# Altium schematic sheet Accessory.SchDoc
size Letter; SheetNumber: 2; SheetTotal: 4
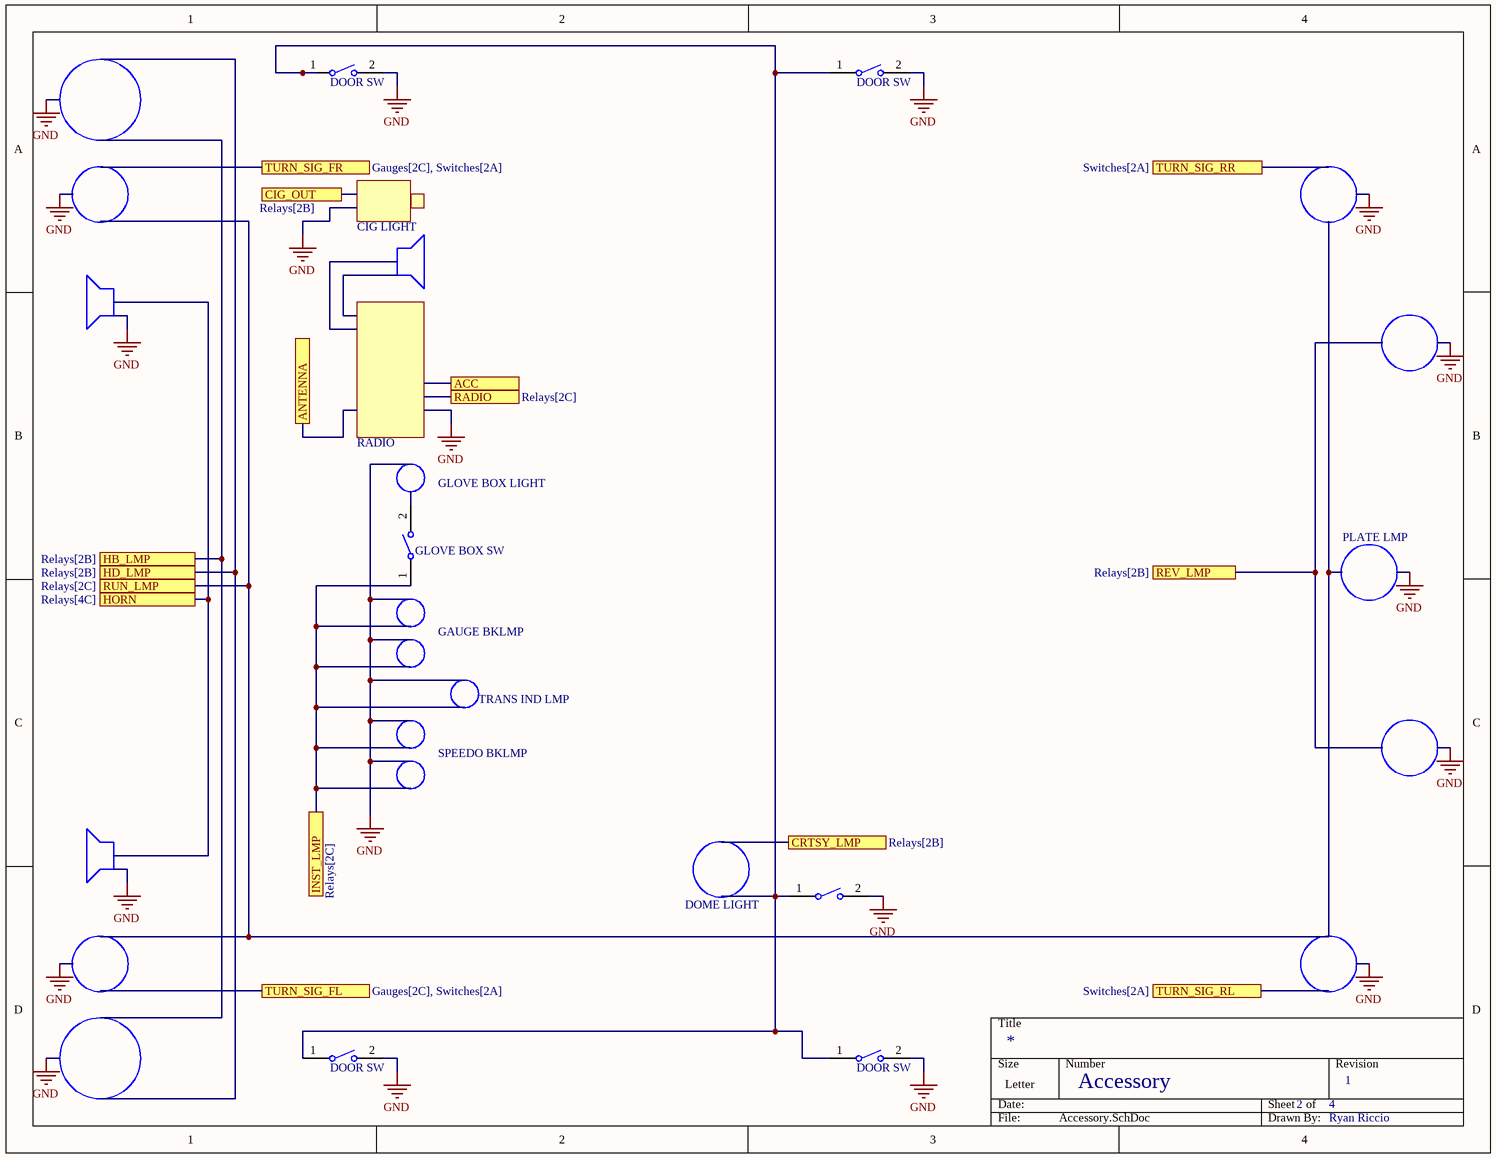
[diagram p0: Accessory.SchDoc]

## Parts
(Parts that share a designator on the sheet are numbered #1, #2 ... from top to bottom, then left to right.)
?#1  DOOR SW  [OMRON-B3U-3000P_V]
?#2  DOOR SW  [OMRON-B3U-3000P_V]
?#3  GLOVE BOX SW  [OMRON-B3U-3000P_V]
?#4  (no value)  [OMRON-B3U-3000P_V]
?#5  DOOR SW  [OMRON-B3U-3000P_V]
?#6  DOOR SW  [OMRON-B3U-3000P_V]

## Ports
ACC (see Relays[1A], Switches[1D]), ANTENNA, CIG_OUT (see Relays[2B]), CRTSY_LMP (see Relays[2B]), HB_LMP (see Relays[2B]), HD_LMP (see Relays[2B]), HORN (see Relays[4C]), INST_LMP (see Relays[2C]), RADIO (see Relays[2C]), REV_LMP (see Relays[2B]), RUN_LMP (see Relays[2C]), TURN_SIG_FL (see Gauges[2C], Switches[2A]), TURN_SIG_FR (see Gauges[2C], Switches[2A]), TURN_SIG_RL (see Switches[2A]), TURN_SIG_RR (see Switches[2A])

## Nets
GND: ?#1.2 ?#2.2 ?#4.2 ?#5.2 ?#6.2
INST_LMP: ?#3.1 ; port INST_LMP
Net?#1_1: ?#1.1 ?#2.1 ?#4.1 ?#5.1 ?#6.1

Not connected (* = marked no-connect by the designer): ?#3 2

## Notes on the sheet
- CIG LIGHT
- RADIO
- GLOVE BOX LIGHT
- PLATE LMP
- GAUGE BKLMP
- TRANS IND LMP
- SPEEDO BKLMP
- DOME LIGHT
- Accessory
- 1
- Ryan Riccio

## Library data of the parts
?#1-?#6 = CMP-011-00005-2: Tactile Switch, SPST-NO, 0.05 A, 12 V, -25 to 70 degC, 2-Pin SMD, RoHS, Tape and Reel; Manufacturer: Omron Electronic Components; Operating Force: 162gf; Voltage Rating (DC): 12V; Current Rating: 50mA; IP Rating: IP40; Throw Configuration: SPST; Max Contact Resistance: 100mohm; RoHS Compliant: True; Contact Current Rating: 50mA; Manufacturer URL: http://www.omron.com/; Packaging: TapeandReel; Max Voltage Rating (DC): 12V; Contact Material: Silver; Datasheet Version: Jan-15; Package Reference: B3U-3000P; Package Description: 2-Pin Surface Mount Device, Body 4 x 3.2 mm; Min Operating Temperature: -25°C; Package Quantity: 4000; Max Operating Temperature: 70°C; Max Current Rating: 50mA; Voltage Rating: 12V; Case/Package: B3U-3000P; Mounting Technology: SM; Datasheet URL: https://www.omron.com/ecb/products/pdf/en-b3u.pdf